# Altium schematic sheet 07_USB_Interface.SchDoc: Mainboard USB
size A3; SheetNumber: 11; SheetTotal: 13
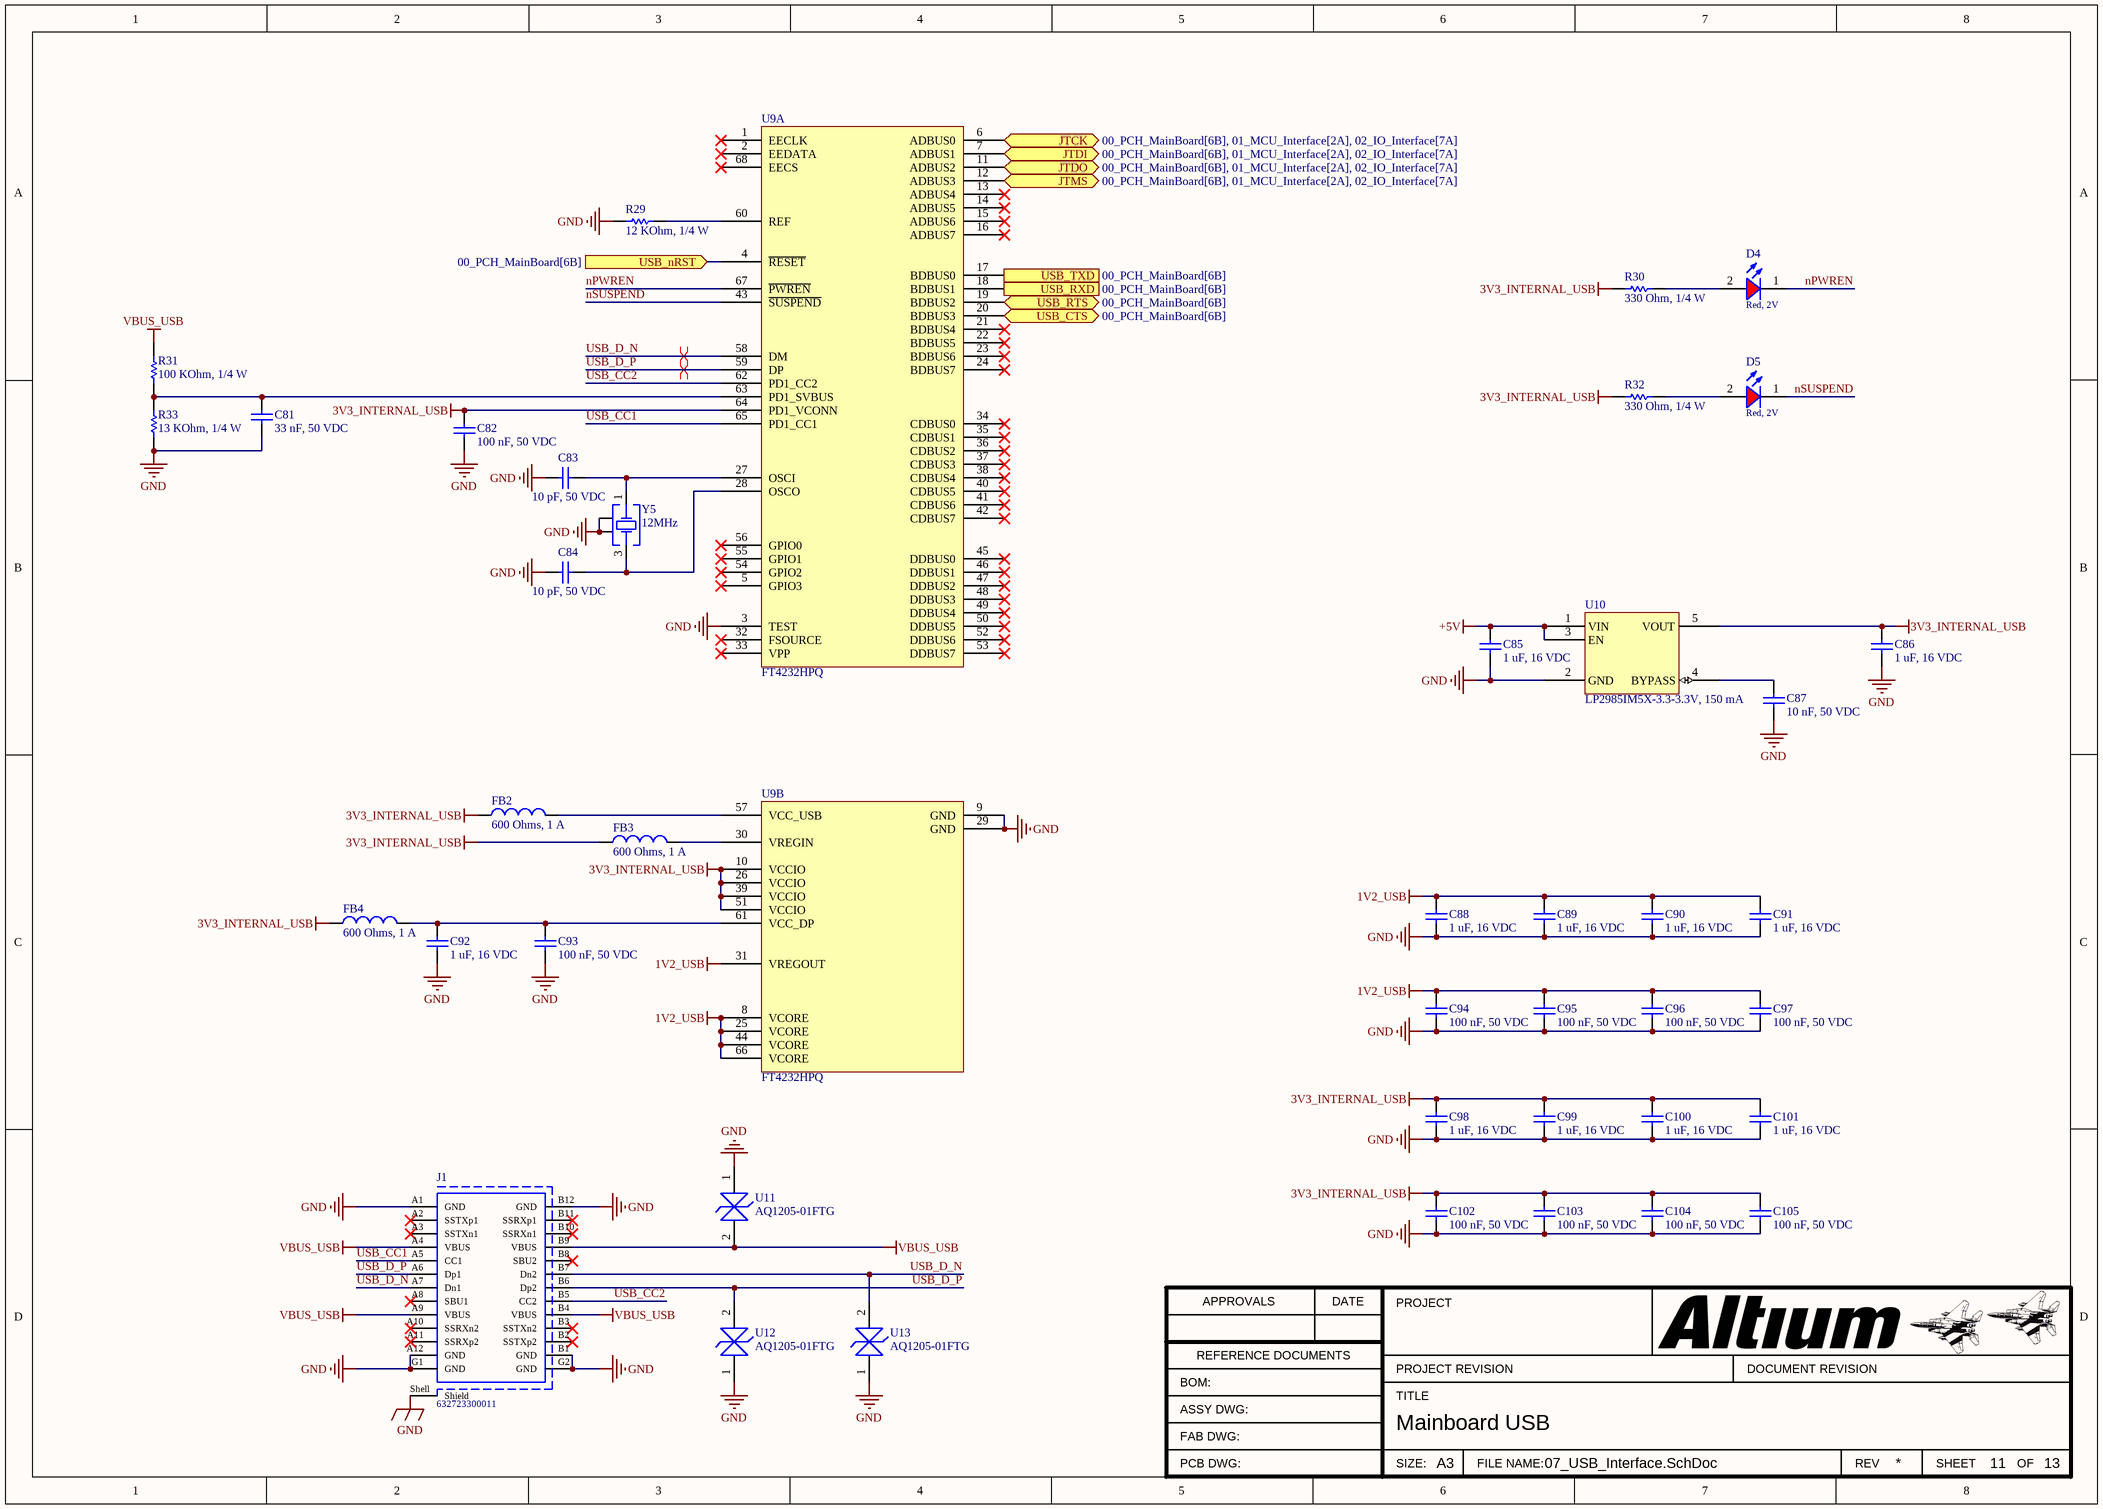
[diagram p0: 07_USB_Interface.SchDoc]

## Parts
C81  33 nF, 50 VDC  [CAP_0603]
C82  100 nF, 50 VDC  [CAP_0603]
C83  10 pF, 50 VDC  [CAP_0603]
C84  10 pF, 50 VDC  [CAP_0603]
C85  1 uF, 16 VDC  [CAP_0603]
C86  1 uF, 16 VDC  [CAP_0603]
C87  10 nF, 50 VDC  [CAP_0603]
C88  1 uF, 16 VDC  [CAP_0603]
C89  1 uF, 16 VDC  [CAP_0603]
C90  1 uF, 16 VDC  [CAP_0603]
C91  1 uF, 16 VDC  [CAP_0603]
C92  1 uF, 16 VDC  [CAP_0603]
C93  100 nF, 50 VDC  [CAP_0603]
C94  100 nF, 50 VDC  [CAP_0603]
C95  100 nF, 50 VDC  [CAP_0603]
C96  100 nF, 50 VDC  [CAP_0603]
C97  100 nF, 50 VDC  [CAP_0603]
C98  1 uF, 16 VDC  [CAP_0603]
C99  1 uF, 16 VDC  [CAP_0603]
C100  1 uF, 16 VDC  [CAP_0603]
C101  1 uF, 16 VDC  [CAP_0603]
C102  100 nF, 50 VDC  [CAP_0603]
C103  100 nF, 50 VDC  [CAP_0603]
C104  100 nF, 50 VDC  [CAP_0603]
C105  100 nF, 50 VDC  [CAP_0603]
D4  Red, 2V  [WL-SMCW_0603_H=0.7mm]
D5  Red, 2V  [WL-SMCW_0603_H=0.7mm]
FB2  600 Ohms, 1 A  [FER_0603]
FB3  600 Ohms, 1 A  [FER_0603]
FB4  600 Ohms, 1 A  [FER_0603]
J1  632723300011  [632723300011]
R29  12 KOhm, 1/4 W  [resistor_0603]
R30  330 Ohm, 1/4 W  [resistor_0603]
R31  100 KOhm, 1/4 W  [resistor_0603]
R32  330 Ohm, 1/4 W  [resistor_0603]
R33  13 KOhm, 1/4 W  [resistor_0603]
U9  FT4232HPQ  [FT4232HPQ]  (parts A,B of 2)
U10  LP2985IM5X-3.3-3.3V, 150 mA  [SOT23-5]
U11  AQ1205-01FTG  [SOD323]
U12  AQ1205-01FTG  [SOD323]
U13  AQ1205-01FTG  [SOD323]
Y5  12MHz  [WE-XTAL_CFPX-180]

## Ports
JTCK (bidir, see 00_PCH_MainBoard[6B], 01_MCU_Interface[2A], 02_IO_Interface[7A]), JTDI (bidir, see 00_PCH_MainBoard[6B], 01_MCU_Interface[2A], 02_IO_Interface[7A]), JTDO (bidir, see 00_PCH_MainBoard[6B], 01_MCU_Interface[2A], 02_IO_Interface[7A]), JTMS (bidir, see 00_PCH_MainBoard[6B], 01_MCU_Interface[2A], 02_IO_Interface[7A]), USB_CTS (bidir, see 00_PCH_MainBoard[6B]), USB_nRST (in, see 00_PCH_MainBoard[6B]), USB_RTS (bidir, see 00_PCH_MainBoard[6B]), USB_RXD (in, see 00_PCH_MainBoard[6B]), USB_TXD (out, see 00_PCH_MainBoard[6B])

## Nets
1V2_USB: C88.2 C89.2 C90.2 C91.2 C94.2 C95.2 C96.2 C97.2 U9.8(VCORE) U9.25(VCORE) U9.31(VREGOUT) U9.44(VCORE) U9.66(VCORE)
3V3_INTERNAL_USB: C82.2 C86.2 C98.2 C99.2 C100.2 C101.2 C102.2 C103.2 C104.2 C105.2 FB2.1 FB3.1 FB4.1 R30.2 R32.2 U9.10(VCCIO) U9.26(VCCIO) U9.39(VCCIO) U9.51(VCCIO) U9.64(PD1_VCONN) U10.5(VOUT)
+5V: C85.2 U10.1(VIN) U10.3(EN)
GND: C81.1 C82.1 C83.1 C84.1 C85.1 C86.1 C87.1 C88.1 C89.1 C90.1 C91.1 C92.1 C93.1 C94.1 C95.1 C96.1 C97.1 C98.1 C99.1 C100.1 C101.1 C102.1 C103.1 C104.1 C105.1 J1.A1(GND) J1.A12(GND) J1.B1(GND) J1.B12(GND) J1.G1(GND) J1.G2(GND) J1.Shell(Shield) R29.1 R33.1 U9.3(TEST) U9.9(GND) U9.29(GND) U10.2(GND) U11.1 U12.1 U13.1 Y5.2(GND) Y5.4(GND)
VBUS_USB: J1.A4(VBUS) J1.A9(VBUS) J1.B4(VBUS) J1.B9(VBUS) R31.2 U11.2
JTCK: U9.6(ADBUS0) ; port JTCK
JTDI: U9.7(ADBUS1) ; port JTDI
JTDO: U9.11(ADBUS2) ; port JTDO
JTMS: U9.12(ADBUS3) ; port JTMS
nPWREN: D4.1(K) U9.67(~{PWREN})
nSUSPEND: D5.1(K) U9.43(~{SUSPEND})
USB_CC1: J1.A5(CC1) U9.65(PD1_CC1)
USB_CC2: J1.B5(CC2) U9.62(PD1_CC2)
USB_CTS: U9.20(BDBUS3) ; port USB_CTS
USB_D_N: J1.A7(Dn1) J1.B7(Dn2) U9.58(DM) U13.2
USB_D_P: J1.A6(Dp1) J1.B6(Dp2) U9.59(DP) U12.2
USB_nRST: U9.4(~{RESET}) ; port USB_nRST
USB_RTS: U9.19(BDBUS2) ; port USB_RTS
USB_RXD: U9.18(BDBUS1) ; port USB_RXD
USB_TXD: U9.17(BDBUS0) ; port USB_TXD
NetC81_2: C81.2 R31.1 R33.2 U9.63(PD1_SVBUS)
NetC83_2: C83.2 U9.27(OSCI) Y5.1(Crystal)
NetC84_2: C84.2 U9.28(OSCO) Y5.3(Crystal)
NetC87_2: C87.2 U10.4(BYPASS)
NetC92_2: C92.2 C93.2 FB4.2 U9.61(VCC_DP)
NetD4_2: D4.2(A) R30.1
NetD5_2: D5.2(A) R32.1
NetFB2_2: FB2.2 U9.57(VCC_USB)
NetFB3_2: FB3.2 U9.30(VREGIN)
NetR29_2: R29.2 U9.60(REF)

Not connected (* = marked no-connect by the designer): J1 A2(SSTXp1)* A3(SSTXn1)* A8(SBU1)* A10(SSRXn2)* A11(SSRXp2)* B2(SSTXp2)* B3(SSTXn2)* B8(SBU2)* B10(SSRXn1)* B11(SSRXp1)*; U9 1(EECLK)* 2(EEDATA)* 5(GPIO3)* 13(ADBUS4)* 14(ADBUS5)* 15(ADBUS6)* 16(ADBUS7)* 21(BDBUS4)* 22(BDBUS5)* 23(BDBUS6)* 24(BDBUS7)* 32(FSOURCE)* 33(VPP)* 34(CDBUS0)* 35(CDBUS1)* 36(CDBUS2)* 37(CDBUS3)* 38(CDBUS4)* 40(CDBUS5)* 41(CDBUS6)* 42(CDBUS7)* 45(DDBUS0)* 46(DDBUS1)* 47(DDBUS2)* 48(DDBUS3)* 49(DDBUS4)* 50(DDBUS5)* 52(DDBUS6)* 53(DDBUS7)* 54(GPIO2)* 55(GPIO1)* 56(GPIO0)* 68(EECS)*

## Layout directives
differential pair: USB_D_N, USB_D_P

## Notes on the sheet
- APPROVALS
- DATE
- PROJECT
- BOM:
- REFERENCE DOCUMENTS
- TITLE
- PROJECT REVISION
- DOCUMENT REVISION
- ASSY DWG:
- FAB DWG:
- PCB DWG:
- SIZE:
- A3
- FILE NAME:
- REV
- SHEET
- OF

## Library data of the parts
C81 = 0106033331050: CAP, size 0603, 33 nF, 50 VDC; Manufacture Name: TDK; Manufacture SN: CGA3E2X7R1H333K080AA; Capacitance: 33 nF; Tolerance: +/-10%; Voltage Rating DC: 50 VDC; ComponentLink2Description: Datasheet; ComponentLink2URL: https://product.tdk.com/system/files/dam/doc/product/capacitor/ceramic/mlcc/catalog/mlcc_automotive_general_en.pdf?ref_disty=mouser; Operating Temperature: -55 to +125degC; Packaging: Tape and Reel; Mounting Technology: SMT; Size: 0603; Supplier 1 Name: Mouser; Supplier 1 SN: 810-CGA3E2X7R1H333K; Supplier 1 URL: https://www.mouser.com/ProductDetail/TDK/CGA3E2X7R1H333K080AA?qs=NRhsANhppD8XLu6u%252B%2FdPcg%3D%3D&utm_source=mouser-refine-download&utm_medium=file&utm_campaign=CGA3E2X7R1H333K080AA&utm_content=TDK; Supplier 2 Name: Digi-Key; Supplier 2 SN: 445-6924-2-ND; Supplier 2 URL: https://www.digikey.com/en/products/detail/tdk-corporation/cga3e2x7r1h333k080aa/2672817; Supplier 3 Name: thegioiic; Supplier 3 SN: N/A; Supplier 3 URL: N/A; Value: 33 nF, 50 VDC
C82 C93-C97 C102-C105 = 0106031041050: CAP, size 0603, 100 nF, 50 VDC; Manufacture Name: TDK; Manufacture SN: CGA3E3X8R1H104K080AE; Capacitance: 100 nF; Tolerance: +/-10%; Voltage Rating DC: 50 VDC; ComponentLink2Description: Datasheet; ComponentLink2URL: https://product.tdk.com/system/files/dam/doc/product/capacitor/ceramic/mlcc/catalog/mlcc_automotive_soft_en.pdf?ref_disty=mouser; Operating Temperature: -55 to +125degC; Packaging: Tape and Reel; Mounting Technology: SMT; Size: 0603; Supplier 1 Name: Mouser; Supplier 1 SN: 810-CGA3E3X8R1H104KA; Supplier 1 URL: https://www.mouser.com/ProductDetail/TDK/CGA3E3X8R1H104K080AE?qs=nQSIdc08i%252Bd8g3IRRgU2bw%3D%3D&utm_source=mouser-refine-download&utm_medium=file&utm_campaign=CGA3E3X8R1H104K080AE&utm_content=TDK; Supplier 2 Name: Digi-Key; Supplier 2 SN: 445-173697-2-ND; Supplier 2 URL: https://www.digikey.com/en/products/detail/tdk-corporation/cga3e3x8r1h104k080ae/5809262; Supplier 3 Name: thegioiic; Supplier 3 SN: N/A; Supplier 3 URL: N/A; Value: 100 nF, 50 VDC
C83 C84 = 0106031000550: CAP, size 0603, 10 pF, 50 VDC; Manufacture Name: TDK; Manufacture SN: CGA3E2NP01H100D080AA; Capacitance: 10 pF; Tolerance: +/-5%; Voltage Rating DC: 50 VDC; ComponentLink2Description: Datasheet; ComponentLink2URL: https://product.tdk.com/system/files/dam/doc/product/capacitor/ceramic/mlcc/catalog/mlcc_automotive_hightemp_en.pdf?ref_disty=mouser; Operating Temperature: -55 to +125degC; Packaging: Tape and Reel; Mounting Technology: SMT; Size: 0603; Supplier 1 Name: Mouser; Supplier 1 SN: 810-CGA3E2NP01H100DA; Supplier 1 URL: https://www.mouser.com/ProductDetail/TDK/CGA3E2NP01H100D080AA?qs=xLDY6iXSiQYSDBjUp7bVxg%3D%3D&utm_source=mouser-refine-download&utm_medium=file&utm_campaign=CGA3E2NP01H100D080AA&utm_content=TDK; Supplier 2 Name: Digi-Key; Supplier 2 SN: 445-12387-2-ND; Supplier 2 URL: https://www.digikey.com/en/products/detail/tdk-corporation/cga3e2np01h100d080aa/3949623; Supplier 3 Name: thegioiic; Supplier 3 SN: N/A; Supplier 3 URL: N/A; Value: 10 pF, 50 VDC
C85 C86 C88-C92 C98-C101 = 0106031051016: CAP, size 0603, 1 uF, 16 VDC; Manufacture Name: Samsung Electro-Mechanics; Manufacture SN: CL10B105KO8NNWC; Capacitance: 1 uF; Tolerance: +/-10%; Voltage Rating DC: 16 VDC; ComponentLink2Description: Datasheet; ComponentLink2URL: https://www.mouser.vn/datasheet/2/585/Samsung_MLCC_1837944-1929650.pdf; Operating Temperature: -55 to +125degC; Packaging: Tape and Reel; Mounting Technology: SMT; Size: 0603; Supplier 1 Name: Mouser; Supplier 1 SN: 187-CL10B105KO8NNWC; Supplier 1 URL: https://www.mouser.vn/ProductDetail/Samsung-Electro-Mechanics/CL10B105KO8NNWC?qs=81r%252BiQLm7BT%252BXtc72qn1ug%3D%3D&utm_source=mouser-refine-download&utm_medium=file&utm_campaign=CL10B105KO8NNWC&utm_content=Samsung-Electro-Mechanics; Supplier 2 Name: Digi-Key; Supplier 2 SN: 1276-CL10B105KO8NNWCTR-ND; Supplier 2 URL: https://www.digikey.com/en/products/detail/samsung-electro-mechanics/cl10b105ko8nnwc/16572783; Supplier 3 Name: thegioiic; Supplier 3 SN: N/A; Supplier 3 URL: https://www.thegioiic.com/tu-gom-0603-1uf-16v; Value: 1 uF, 16 VDC
C87 = 0106031030550: CAP, size 0603, 10 nF, 50 VDC; Manufacture Name: TDK; Manufacture SN: CGA3E2C0G1H103J080AE; Capacitance: 10 nF; Tolerance: +/-5%; Voltage Rating DC: 50 VDC; ComponentLink2Description: Datasheet; ComponentLink2URL: https://product.tdk.com/system/files/dam/doc/product/capacitor/ceramic/mlcc/catalog/mlcc_automotive_soft_en.pdf?ref_disty=mouser; Operating Temperature: -55 to +125degC; Packaging: Tape and Reel; Mounting Technology: SMT; Size: 0603; Supplier 1 Name: Mouser; Supplier 1 SN: 810-CGA3E2C0G1H103J8; Supplier 1 URL: https://www.mouser.com/ProductDetail/TDK/CGA3E2C0G1H103J080AE?qs=P1JMDcb91o6ZkMITrWTUZQ%3D%3D&utm_source=mouser-refine-download&utm_medium=file&utm_campaign=CGA3E2C0G1H103J080AE&utm_content=TDK; Supplier 2 Name: Digi-Key; Supplier 2 SN: 445-CGA3E2C0G1H103J080AETR-ND; Supplier 2 URL: https://www.digikey.com/en/products/detail/tdk-corporation/cga3e2c0g1h103j080ae/11697946; Supplier 3 Name: thegioiic; Supplier 3 SN: N/A; Supplier 3 URL: N/A; Value: 10 nF, 50 VDC
D4 D5 = 160603RedBlur: WL-SMCW SMT Mono-color Chip LED Blur, size 0603, Red, 2V, 140deg; Color: Red; Size: 0603; Type: Blur; ComponentLink1Description: Datasheet link; ComponentLink1URL: N/A; ComponentLink2Description: Supplier 1 URL; ComponentLink2URL: https://www.mouser.vn/ProductDetail/ROHM-Semiconductor/CSL1901VW1?qs=vvQtp7zwQdNmrXZcE27xEA%3D%3D; ComponentLink3Description: Supplier 2 URL; ComponentLink3URL: https://www.digikey.com/en/products/detail/rohm-semiconductor/SML-D12U8WT86/1641799; ComponentLink4Description: Supplier 3 URL; ComponentLink4URL: N/A; Supplier 1 Name: Mouser; Supplier 1 SN: 755-CSL1901VW1; Supplier 1 URL: https://www.mouser.vn/ProductDetail/ROHM-Semiconductor/CSL1901VW1?qs=vvQtp7zwQdNmrXZcE27xEA%3D%3D; Supplier 2 Name: Digi-Key; Supplier 2 SN: 511-1580-2-ND; Supplier 2 URL: https://www.digikey.com/en/products/detail/rohm-semiconductor/SML-D12U8WT86/1641799; Supplier 3 Name: ICDayRoi; Supplier 3 SN: N/A; Supplier 3 URL: N/A; Value: Red, 2V
FB2-FB4 = 03060360110225: Ferrite, 0603, 600 Ohms, 1 A; Manufacture Name: Wurth Elektronik; Manufacture SN: 742792651; Tolerance: +/-25%; Maximum DC Current: 1 A; Maximum DC Resistance: 200 mOhms; Test Frequency: 100 MHz; ComponentLink2Description: Datasheet; ComponentLink2URL: https://www.we-online.com/catalog/datasheet/742792651.pdf; Mounting Technology: SMT; Operating Temperature: -55 to +125degC; Packaging: Tape and Reel; Size: 0603; Supplier 1 SN: 710-742792651; Supplier 1 URL: https://www.mouser.com/ProductDetail/Wurth-Elektronik/742792651?qs=sGAEpiMZZMt1hubY80%2Fs8M60rIzA20dgTaAssd1%2FEf4%3D&utm_source=mouser-refine-download&utm_medium=file&utm_campaign=742792651&utm_content=Wurth-Elektronik; Supplier 2 SN: N/A; Supplier 2 URL: N/A; Supplier 3 SN: N/A; Supplier 3 URL: N/A; Supplier 1 Name: Mouser; Supplier 2 Name: Digi-Key; Supplier 3 Name: thegioiic; Impedance: 600 Ohms; Value: 600 Ohms, 1 A
J1 = 632723300011: USB 3.1 Type C Receptacle WR-COM, Horizontal, SMT / THT; Rated Current: 5 A; Contact Resistance: 30 mOhm; Working Voltage: 20 VDC; ComponentLink1Description: Datasheet; ComponentLink1URL: https://katalog.we-online.de/em/datasheet/632723x00011%282%29.pdf; ComponentLink2Description: Supplier 1 URL; ComponentLink2URL: N/A; Part Number: 632723300011; Published Date: September 2018; Publisher: Wurth Elektronik; Orientation: Horizontal; Connector Type: USB 3.1 Type C; Operating Temperature: -40 to 105 degC; Mounting Technology: SMT / THT; Gender: Receptacle; Packaging: Tape and Reel; ComponentLink4Description: Supplier 3 URL; ComponentLink4URL: https://www.mouser.vn/c/?q=632723300011; ComponentLink3Description: Supplier 2 URL; ComponentLink3URL: N/A; Supplier 1 Name: Mouser; Supplier 1 SN: 710-632723300011; Supplier 1 URL: https://www.mouser.vn/ProductDetail/Wurth-Elektronik/632723300011?qs=NK6InXoXhq4%252B5eM1PePLPg%3D%3D; Supplier 2 Name: Digi-Key; Supplier 2 SN: N/A; Supplier 2 URL: N/A; Supplier 3 Name: thegioiic; Supplier 3 SN: N/A; Supplier 3 URL: https://www.thegioiic.com/cong-usb-cai-3-1-type-c-24-chan-cong-90-do; Value: USB 3.1 Type C
R29 = 0006031231: RES, size 0603, 12 KOhm, 1/4 W; Manufacture  Name: OEM; Resistance: 12 KOhm; Rated Power: 1/4 W; Resistance Tolerance: +/-1%; Size: 0603; Mounting Technology: SMT; Supplier 1 Name: Mouser; Supplier 1 SN: 71-RCS060312K0FKEA; Supplier 2 Name: Digi-Key; Supplier 2 SN: 541-10428-2-ND 541-10428-1-ND 541-10428-6-ND; Supplier 1 URL: https://www.mouser.vn/ProductDetail/Vishay-Dale/RCS060312K0FKEA?qs=sGAEpiMZZMvdGkrng054t9clqp6gtJJdYU2CGrvXFnAdCOf%2F3daJvA%3D%3D; Supplier 3 Name: thegioiic; Supplier 3 SN: N/A; Supplier 3 URL: N/A; Manufacture  SN: OEM; Value: 12 KOhm, 1/4 W; ComponentLink1Description: Datasheet link; ComponentLink1URL: https://www.vishay.com/doc?20065; ComponentLink2Description: Supplier 1 URL; ComponentLink2URL: N/A; ComponentLink3Description: Supplier 2 URL; ComponentLink3URL: https://www.digikey.com/en/products/detail/vishay-dale/RCS060312K0FKEA/5868600; ComponentLink4Description: Supplier 3 URL; ComponentLink4URL: N/A; Supplier 2 URL: https://www.digikey.com/en/products/detail/vishay-dale/RCS060312K0FKEA/5868600
R30 R32 = 0006033311: RES, size 0603, 330 Ohm, 1/4 W; Manufacture  Name: OEM; Resistance: 330 Ohm; Rated Power: 1/4 W; Resistance Tolerance: +/-1%; Size: 0603; Mounting Technology: SMT; Supplier 1 Name: Mouser; Supplier 1 SN: 667-ERJ-UP3F3300V; Supplier 2 Name: Digi-Key; Supplier 2 SN: 10-ERJ-UP3F3300VTR-ND 10-ERJ-UP3F3300VCT-ND 10-ERJ-UP3F3300VDKR-ND; Supplier 1 URL: https://www.mouser.vn/ProductDetail/Panasonic/ERJ-UP3F3300V?qs=sGAEpiMZZMvdGkrng054twq3eZrCFN89MDZusw5Tf7mZnfRSpxxqIA%3D%3D; Supplier 3 Name: thegioiic; Supplier 3 SN: N/A; Supplier 3 URL: N/A; Manufacture  SN: OEM; Value: 330 Ohm, 1/4 W; ComponentLink1Description: Datasheet link; ComponentLink1URL: https://api.pim.na.industrial.panasonic.com/file_stream/main/fileversion/4484; ComponentLink2Description: Supplier 1 URL; ComponentLink2URL: N/A; ComponentLink3Description: Supplier 2 URL; ComponentLink3URL: https://www.digikey.com/en/products/detail/panasonic-electronic-components/ERJ-UP3F3300V/12093106; ComponentLink4Description: Supplier 3 URL; ComponentLink4URL: N/A; Supplier 2 URL: https://www.digikey.com/en/products/detail/panasonic-electronic-components/ERJ-UP3F3300V/12093106
R31 = 0006031041: RES, size 0603, 100 KOhm, 1/4 W; Manufacture  Name: OEM; Rated Power: 1/4 W; Resistance Tolerance: +/-1%; Resistance: 100 KOhm; Size: 0603; Mounting Technology: SMT; Supplier 1 Name: Mouser; Supplier 1 SN: 603-SR0603FR-7T100KL; Supplier 2 Name: Digi-Key; Supplier 2 SN: YAG5821TR-ND YAG5821CT-ND YAG5821DKR-ND; Supplier 1 URL: https://www.mouser.vn/ProductDetail/YAGEO/SR0603FR-7T100KL?qs=sGAEpiMZZMvdGkrng054tz1y1XEHv7sNa%252BA%2F4WiDMf7aGw4zRBb%2FFQ%3D%3D; Supplier 3 Name: thegioiic; Supplier 3 SN: N/A; Supplier 3 URL: N/A; Manufacture  SN: OEM; Value: 100 KOhm, 1/4 W; ComponentLink1Description: Datasheet link; ComponentLink1URL: https://www.yageo.com/upload/media/product/productsearch/datasheet/rchip/PYu-SR_20105_RoHS_L_10.pdf; ComponentLink2Description: Supplier 1 URL; ComponentLink2URL: N/A; ComponentLink3Description: Supplier 2 URL; ComponentLink3URL: https://www.digikey.com/en/products/detail/yageo/SR0603FR-7T100KL/9373095; ComponentLink4Description: Supplier 3 URL; ComponentLink4URL: N/A; Supplier 2 URL: https://www.digikey.com/en/products/detail/yageo/SR0603FR-7T100KL/9373095
R33 = 0006031331: RES, size 0603, 13 KOhm, 1/4 W; Manufacture  Name: OEM; Resistance: 13 KOhm; Rated Power: 1/4 W; Resistance Tolerance: +/-1%; Size: 0603; Mounting Technology: SMT; Supplier 1 Name: Mouser; Supplier 1 SN: 755-ESR03EZPF1302; Supplier 2 Name: Digi-Key; Supplier 2 SN: ESR03EZPF1302-ND; Supplier 1 URL: https://www.mouser.vn/ProductDetail/ROHM-Semiconductor/ESR03EZPF1302?qs=sGAEpiMZZMvdGkrng054tywGjayRHxH2BixSkNTZUClpiy4%252BI%252BxkXA%3D%3D; Supplier 3 Name: thegioiic; Supplier 3 SN: N/A; Supplier 3 URL: N/A; Manufacture  SN: OEM; Value: 13 KOhm, 1/4 W; ComponentLink1Description: Datasheet link; ComponentLink1URL: https://fscdn.rohm.com/en/products/databook/datasheet/passive/resistor/chip_resistor/esr-e.pdf; ComponentLink2Description: Supplier 1 URL; ComponentLink2URL: N/A; ComponentLink3Description: Supplier 2 URL; ComponentLink3URL: https://www.digikey.com/en/products/detail/rohm-semiconductor/ESR03EZPF1302/4007159; ComponentLink4Description: Supplier 3 URL; ComponentLink4URL: N/A; Supplier 2 URL: https://www.digikey.com/en/products/detail/rohm-semiconductor/ESR03EZPF1302/4007159
U9 = FT4232HPQ: USB Interface IC USB Bridge Type-C 3.0 32-Bit 8kB 48kB; Manufacturer: FTDI; Data rate: 12 Mb/s; Numbers of Ports: 2 Port; Pad count: 68; Speed: High Speed (HS); Supply voltage: 1.08 V to 1.32 V; Active: Active; ComponentLink1Description: Datasheet; ComponentLink1URL: https://www.mouser.com/datasheet/2/163/DS_FT4233HP-3135614.pdf; Footprint name: QFN-68; Manufacture SN: FT4232HPQ; Standard: USB-C 3.0; ComponentLink2Description: Supplier 1 URL; ComponentLink2URL: https://www.mouser.com/ProductDetail/FTDI/FT4232HPQ-TRAY?qs=DRkmTr78QATL4FSPfVZC7Q%3D%3D; ComponentLink3Description: Supplier 2 URL; ComponentLink3URL: https://www.digikey.com/en/products/detail/ftdi-future-technology-devices-international-ltd/ft4232hpq-tray/13981003; ComponentLink4Description: Supplier 3 URL; ComponentLink4URL: N.A; Supplier 1 Name: Mouser; Supplier 1 SN: 895-FT4232HPQ-TRAY; Supplier 1 URL: https://www.mouser.com/ProductDetail/FTDI/FT4232HPQ-TRAY?qs=DRkmTr78QATL4FSPfVZC7Q%3D%3D; Supplier 2 Name: Digi-Key; Supplier 2 SN: 768-FT4232HPQ-TRAY-ND; Supplier 2 URL: https://www.digikey.com/en/products/detail/ftdi-future-technology-devices-international-ltd/ft4232hpq-tray/13981003; Supplier 3 Name: thegioiic; Supplier 3 SN: N.A; Supplier 3 URL: N.A; Value: FT4232HPQ
U10 = LP2985IM5X-3.3/NOPBSOT23: Out: 3.3V, 150 mA max; In: 2.5 V to 16 V; Pacakge: SOT-23-5; Manufacturer: Texas Instruments; Voltage Input: 2.5V - 16V; Current Output: 150 mA; Package: SOT-23-5; ComponentLink1Description: Datasheet link; ComponentLink1URL: https://www.ti.com/lit/ds/symlink/lp2985.pdf?ts=1690340207505&ref_url=https%253A%252F%252Fwww.ti.com%252Fproduct%252FLP2985%253FkeyMatch%253DLM2985; ComponentLink2Description: Supplier 1 URL; ComponentLink2URL: https://www.mouser.vn/ProductDetail/Texas-Instruments/LP2985IM5X-3.3-NOPB?qs=7lkVKPoqpbarYOItF3geeg%3D%3D; ComponentLink3Description: Supplier 2 URL; ComponentLink3URL: https://www.digikey.com/en/products/detail/texas-instruments/LP2985IM5X-3-3-NOPB/367679; ComponentLink4Description: Supplier 3 URL; ComponentLink4URL: https://www.thegioiic.com/lp2985-33dbvr-ic-on-ap-3-3v-150ma; Supplier 1 Name: Mouser; Supplier 1 SN: 926-LP2985IM5X33NOPB; Supplier 1 URL: https://www.mouser.vn/ProductDetail/Texas-Instruments/LP2985IM5X-3.3-NOPB?qs=7lkVKPoqpbarYOItF3geeg%3D%3D; Supplier 2 Name: Digi-Key; Supplier 2 SN: LP2985IM5X-3.3/NOPBTR-ND; Supplier 2 URL: https://www.digikey.com/en/products/detail/texas-instruments/LP2985IM5X-3-3-NOPB/367679; Supplier 3 Name: thegioiic; Supplier 3 SN: N/A; Supplier 3 URL: https://www.thegioiic.com/lp2985-33dbvr-ic-on-ap-3-3v-150ma; Value: LP2985IM5X-3.3-3.3V, 150 mA; Voltage Output: 3.3V; Manufacturer Part Number: LP2985IM5X-3.3; Mounting Technology: SMD
U11-U13 = AQ1205-01FTG: ESD Suppressors / TVS Diodes 5V 7A 30kV SOD323 Bi-dir TVS; Manufacture: Littelfuse; Breakdown Voltage: 5.1V; Clamping Voltage: 10V; Diode Capacitance: 7pF; Number of Channels: 1; ComponentLink1Description: Datasheet; ComponentLink1URL: https://www.mouser.vn/datasheet/2/240/media-3320499.pdf; Manufacture SN: AQ1205-01FTG; Operating Temperature: -40 - 150; Peak Pulse Current: 7A; Peak Pulse Power Dissipation: N/A; Voltage ESD Air Gap: 30kV; Voltage ESD Contact: 30kV; Working Voltage: 5V; Supplier 1 Name: Mouser; Supplier 1 SN: 576-AQ1205-01FTG; Supplier 1 URL: https://www.mouser.vn/ProductDetail/Littelfuse/AQ1205-01FTG?qs=tlsG%2FOw5FFgT817I6cPGrg%3D%3D; Supplier 2 Name: Digi-Key; Supplier 2 SN: 18-AQ1205-01FTGTR-ND; Supplier 2 URL: https://www.digikey.com/en/products/detail/littelfuse-inc/aq1205-01ftg/17128325; Supplier 3 Name: thegioiic; Supplier 3 SN: N/A; Supplier 3 URL: N/A
Y5 = 073525126010: WE-XTAL Quartz Crystal, SMT, CFPX-180, 12MHz, +/-30ppm; Manufacturer Part Number: NX3225SA-12MHZ-STD-CSR-6; Manufacturer: NDK; Frequency Stability: +/-25ppm; Load Capacitance: 8pF; Frequency Tolerance: +/-15ppm; ComponentLink2Description: Supplier 1 URL; ComponentLink2URL: https://www.mouser.com/ProductDetail/NDK/NX3225SA-12MHZ-STD-CSR-6?qs=55YtniHzbhCh3aOy4zgUJQ%3D%3D; Operating Temperature: -20 to +70degC; Size: CFPX-104/5032; Frequency: 12MHz; Mounting Technology: SMT; Supplier 3 Name: thegioiic; Supplier 3 SN: N/A; Supplier 3 URL: https://www.thegioiic.com/thach-anh-12mhz-5032-4-chan-smd; ComponentLink1Description: Datasheet link; ComponentLink1URL: https://www.mouser.com/datasheet/2/905/c_NX3225SA_e-1317523.pdf; ComponentLink3Description: Supplier 2 URL; ComponentLink3URL: https://www.digikey.com/en/products/detail/ndk-america-inc/NX3225SA-12MHZ-STD-CSR-6/3125639; ComponentLink4Description: Supplier 3 URL; ComponentLink4URL: https://www.thegioiic.com/thach-anh-12mhz-5032-4-chan-smd; Supplier 1 Name: Mouser; Supplier 1 SN: 344-NX3225SA12MCSR6; Supplier 1 URL: https://www.mouser.com/ProductDetail/NDK/NX3225SA-12MHZ-STD-CSR-6?qs=55YtniHzbhCh3aOy4zgUJQ%3D%3D; Supplier 2 Name: Digi-Key; Supplier 2 SN: 644-1180-2-ND; Supplier 2 URL: https://www.digikey.com/en/products/detail/ndk-america-inc/NX3225SA-12MHZ-STD-CSR-6/3125639; Value: 12MHz